# EAGLE design small_encoder_board (EAGLE 9.4.2)

## Sheet 1 of 4
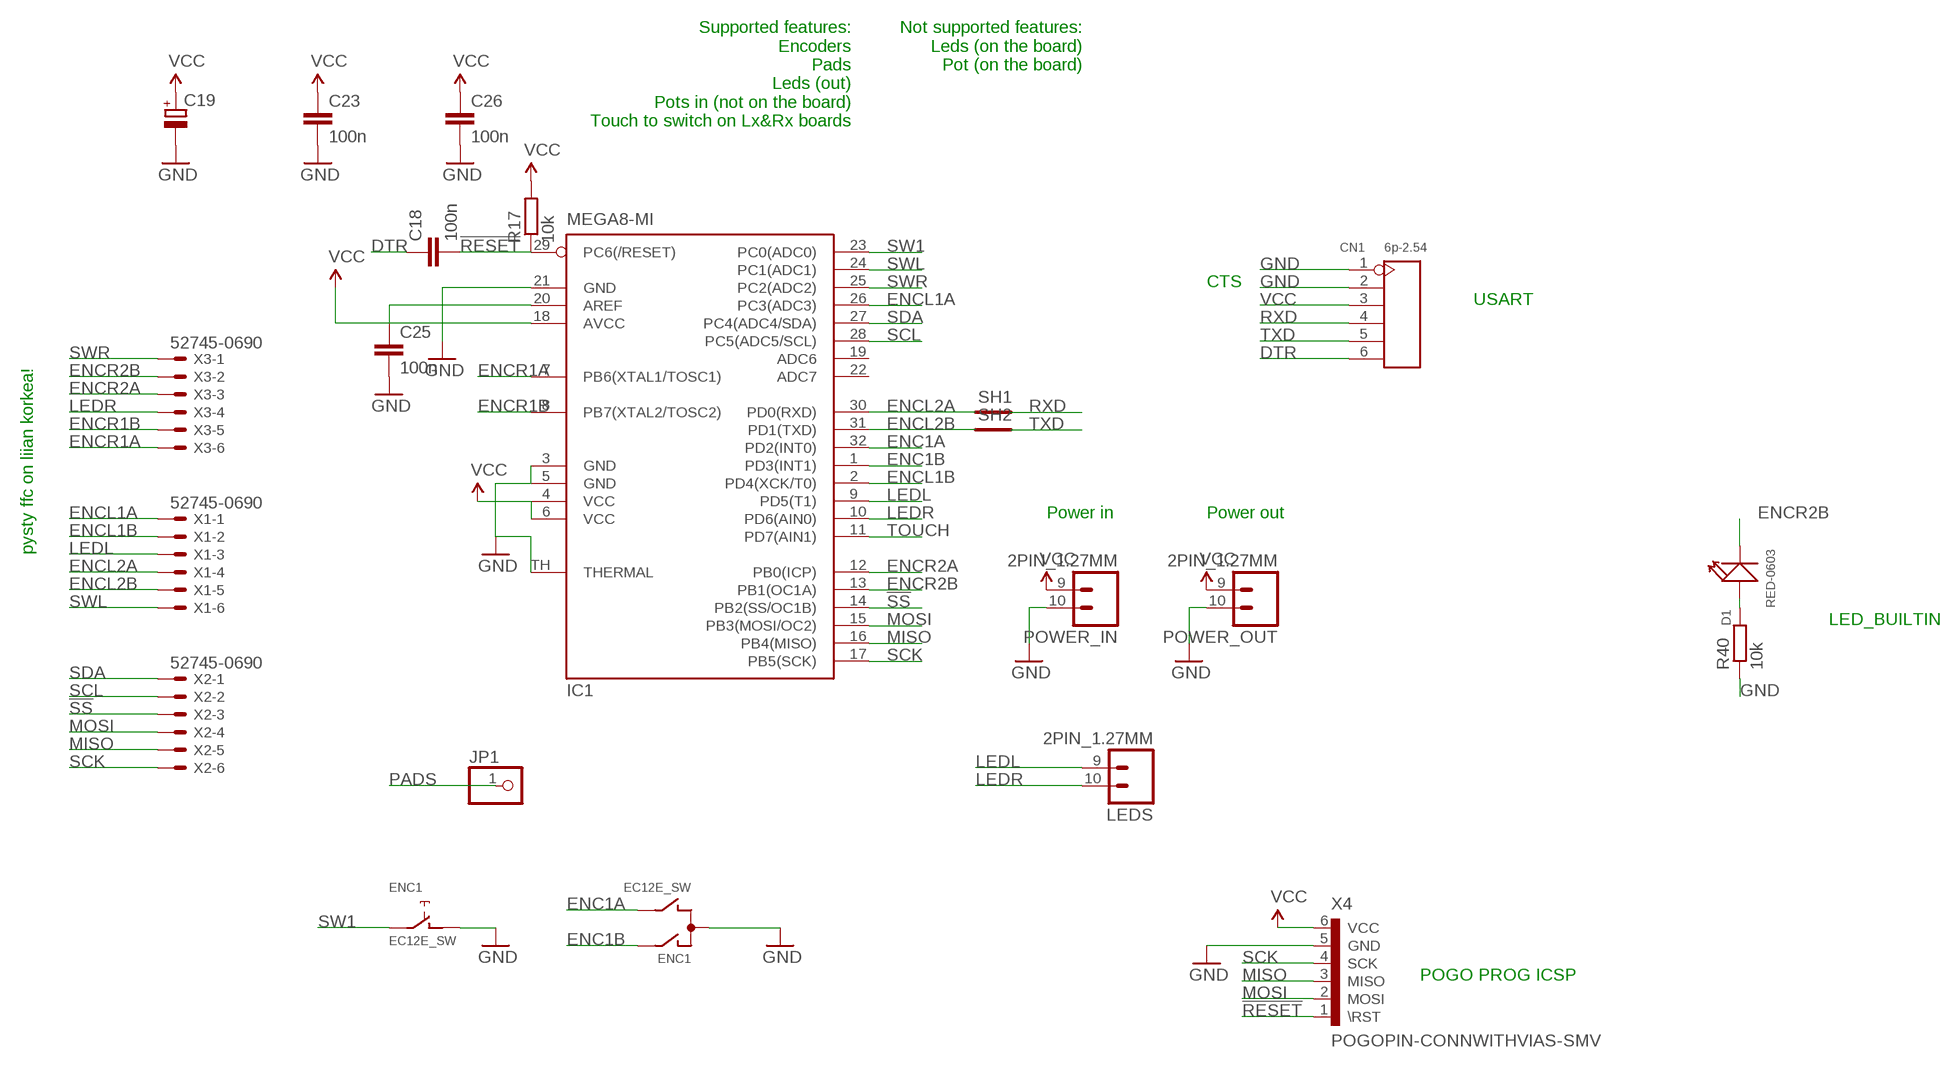
[diagram p0: schematic, sheet 1]

### Parts
C18  100n  CAP0603-CAP  [0603-CAP]
C19  CPOL-EUC  [PANASONIC_C]
C23  100n  CAP0603-CAP  [0603-CAP]
C25  100n  CAP0603-CAP  [0603-CAP]
C26  100n  CAP0603-CAP  [0603-CAP]
CN1  6p-2.54  DIP-BLACK-FEMALE-HEADER-VERT(6P-2.54)  [H6-2.54]
D1  RED-0603  LED-SMD-RED-DIFFUSED(0603)  [LED-0603]
ENC1  EC12E_SW  [ALPS_EC12E_SW]
IC1  MEGA8-MI  [MLF32-TH]
JP1  PINHD-1X1  [1X01]
LEDS  2PIN_1.27MM  [1X02_1.27MM_NO_SILK]
POWER_IN  2PIN_1.27MM  [1X02_1.27MM_NO_SILK]
POWER_OUT  2PIN_1.27MM  [1X02_1.27MM_NO_SILK]
R17  10k  R-EU_R0603  [R0603]
R40  10k  R-EU_R0603  [R0603]
SH1  SHORT  [SHORT_TOP_8MIL]
SH2  SHORT  [SHORT_TOP_8MIL]
X1  52745-0690  [52745-0690]
X2  52745-0690  [52745-0690]
X3  52745-0690  [52745-0690]
X4  POGOPIN-CONNWITHVIAS-SMV  [POGOPROG-CONN-OH-SMALLERVIAS]

### Nets
!RESET: C18.2 IC1.29(PC6(/RESET)) R17.1 X4.1(\RST)
!SS: IC1.14(PB2(SS/OC1B)) X2.3
AREF: C25.1 IC1.20(AREF)
DTR: C18.1 CN1.6
ENC1A: ENC1.B IC1.32(PD2(INT0)) ; also sheet 4
ENC1B: ENC1.A IC1.1(PD3(INT1)) ; also sheet 4
ENCL1A: IC1.26(PC3(ADC3)) X1.1 ; also sheet 4
ENCL1B: IC1.2(PD4(XCK/T0)) X1.2 ; also sheet 4
ENCL2A: IC1.30(PD0(RXD)) SH1.P$1 X1.4 ; also sheet 4
ENCL2B: IC1.31(PD1(TXD)) SH2.P$1 X1.5 ; also sheet 4
ENCR1A: IC1.7(PB6(XTAL1/TOSC1)) X3.6 ; also sheet 4
ENCR1B: IC1.8(PB7(XTAL2/TOSC2)) X3.5 ; also sheet 4
ENCR2A: IC1.12(PB0(ICP)) X3.3 ; also sheet 4
ENCR2B: D1.- IC1.13(PB1(OC1A)) X3.2 ; also sheet 4
GND: C19.- C23.2 C25.2 C26.2 CN1.1 CN1.2 ENC1.C ENC1.D IC1.3(GND) IC1.5(GND) IC1.21(GND) IC1.TH(THERMAL) POWER_IN.10 POWER_OUT.10 R40.1 X4.5(GND) ; also sheet 2,3
LEDL: IC1.9(PD5(T1)) LEDS.9 X1.3
LEDR: IC1.10(PD6(AIN0)) LEDS.10 X3.4
MISO: IC1.16(PB4(MISO)) X2.5 X4.3(MISO) ; also sheet 2
MOSI: IC1.15(PB3(MOSI/OC2)) X2.4 X4.2(MOSI) ; also sheet 2
N$31: D1.+ R40.2
PADS: JP1.1 ; also sheet 4
RXD: CN1.4 SH1.P$2
SCK: IC1.17(PB5(SCK)) X2.6 X4.4(SCK) ; also sheet 2
SCL: IC1.28(PC5(ADC5/SCL)) X2.2
SDA: IC1.27(PC4(ADC4/SDA)) X2.1
SW1: ENC1.E IC1.23(PC0(ADC0)) ; also sheet 4
SWL: IC1.24(PC1(ADC1)) X1.6 ; also sheet 4
SWR: IC1.25(PC2(ADC2)) X3.1 ; also sheet 4
TOUCH: IC1.11(PD7(AIN1)) ; also sheet 3,4
TXD: CN1.5 SH2.P$2
VCC: C19.+ C23.1 C26.1 CN1.3 IC1.4(VCC) IC1.6(VCC) IC1.18(AVCC) POWER_IN.9 POWER_OUT.9 R17.2 X4.6(VCC) ; also sheet 3
Unconnected: ENC1.GND1(G) ENC1.GND2(G) IC1.19(ADC6) IC1.22(ADC7)

### Notes on the sheet
- Supported features:
  Encoders
  Pads
  Leds (out)
  Pots in (not on the board)
  Touch to switch on Lx&Rx boards
- Not supported features:
  Leds (on the board)
  Pot (on the board)
- CTS
- USART
- Power in | Power out
- pysty ffc on liian korkea!
- LED_BUILTIN
- POGO PROG ICSP

## Sheet 2 of 4
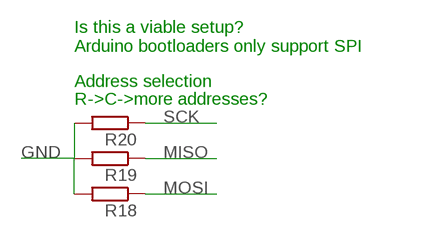
[diagram p1: schematic, sheet 2]

### Parts
R18  R-EU_R0603  [R0603]
R19  R-EU_R0603  [R0603]
R20  R-EU_R0603  [R0603]

### Nets
GND: R18.2 R19.2 R20.2 ; also sheet 1,3
MISO: R19.1 ; also sheet 1
MOSI: R18.1 ; also sheet 1
SCK: R20.1 ; also sheet 1

### Notes on the sheet
- Is this a viable setup?
  Arduino bootloaders only support SPI
- Address selection
- R->C->more addresses?

## Sheet 3 of 4
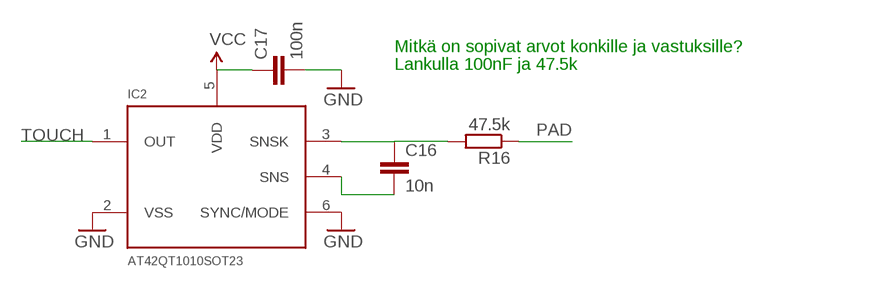
[diagram p2: schematic, sheet 3]

### Parts
C16  10n  CAP0603-CAP  [0603-CAP]
C17  100n  CAP0603-CAP  [0603-CAP]
IC2  AT42QT1010SOT23  [SOT23-6]
R16  47.5k  R-EU_R0603  [R0603]

### Nets
GND: C17.2 IC2.2(VSS) IC2.6(SYNC/MODE) ; also sheet 1,2
N$7: C16.1 IC2.3(SNSK) R16.2
N$15: C16.2 IC2.4(SNS)
PAD: R16.1
TOUCH: IC2.1(OUT) ; also sheet 1,4
VCC: C17.1 IC2.5(VDD) ; also sheet 1

### Notes on the sheet
- Mitkä on sopivat arvot konkille ja vastuksille?
- Lankulla 100nF ja 47.5k

## Sheet 4 of 4
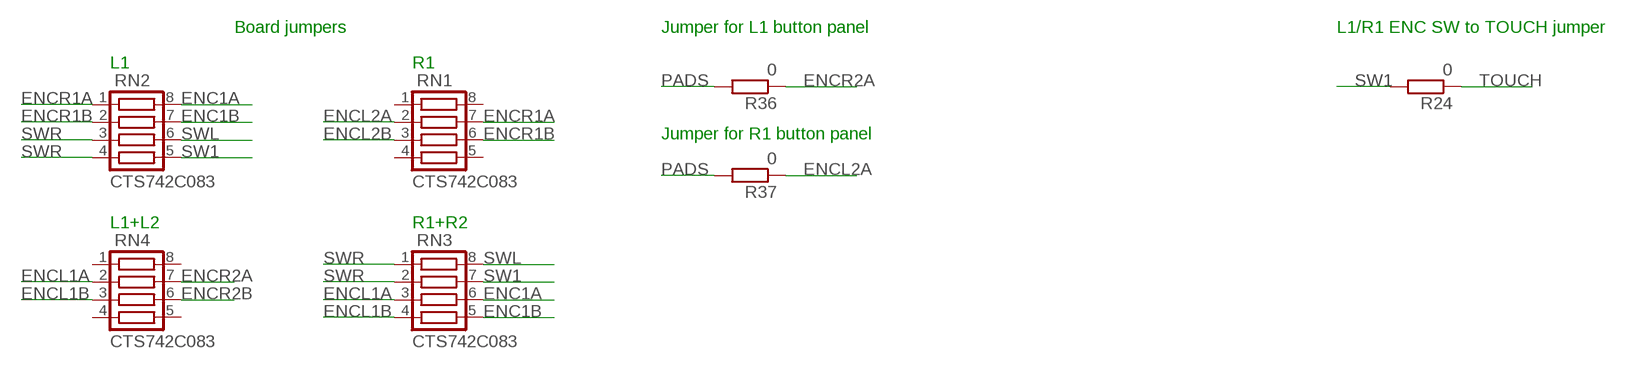
[diagram p3: schematic, sheet 4]

### Parts
R24  0  R-EU_R0603  [R0603]
R36  0  R-EU_R0603  [R0603]
R37  0  R-EU_R0603  [R0603]
RN1  CTS742C083  [CTS742C083]
RN2  CTS742C083  [CTS742C083]
RN3  CTS742C083  [CTS742C083]
RN4  CTS742C083  [CTS742C083]

### Nets
ENC1A: RN2.8 RN3.6 ; also sheet 1
ENC1B: RN2.7 RN3.5 ; also sheet 1
ENCL1A: RN3.3 RN4.2 ; also sheet 1
ENCL1B: RN3.4 RN4.3 ; also sheet 1
ENCL2A: R37.1 RN1.2 ; also sheet 1
ENCL2B: RN1.3 ; also sheet 1
ENCR1A: RN1.7 RN2.1 ; also sheet 1
ENCR1B: RN1.6 RN2.2 ; also sheet 1
ENCR2A: R36.1 RN4.7 ; also sheet 1
ENCR2B: RN4.6 ; also sheet 1
PADS: R36.2 R37.2 ; also sheet 1
SW1: R24.2 RN2.5 RN3.7 ; also sheet 1
SWL: RN2.6 RN3.8 ; also sheet 1
SWR: RN2.3 RN2.4 RN3.1 RN3.2 ; also sheet 1
TOUCH: R24.1 ; also sheet 1,3
Unconnected: RN1.1 RN1.4 RN1.5 RN1.8 RN4.1 RN4.4 RN4.5 RN4.8

### Notes on the sheet
- Board jumpers | Jumper for L1 button panel | L1/R1 ENC SW to TOUCH jumper
- L1 | R1
- Jumper for R1 button panel
- L1+L2 | R1+R2

## Library data of the parts
C16-C18 C23 C25 C26 = SparkFun-Capacitors:CAP: Capacitor Standard 0603 ceramic capacitor, and 0.1" leaded capacitor.
C19 = rcl:CPOL-EU: POLARIZED CAPACITOR, European symbol; SPICEPREFIX: C
CN1 = i2c_encoder:DIP-BLACK-FEMALE-HEADER-VERT(6P-2.54): 320030060; MPN: F185-1106A1BSYC1
D1 = Seeed-LED-2016:LED-SMD-RED-DIFFUSED(0603): 304090042; MPN: 19-217-R6C-AL1M2VY-3T
ENC1 = switch_pec:EC12E_SW: ALPS rotary Encoder EC12E series with switch; MPN: EC12E2424407; OC_FARNELL: 1520813; OC_NEWARK: 74M1068
IC1 = atmel:MEGA8-MI: MICROCONTROLLER 8 Kbytes FLASH, 1 kbytes SRAM, 512 bytes EEPROM, USART, 6-channel 10 bit ADC, 2-channel 8 bit ADC Pin compatible with Atmega48, ATMega88, ATMega168 Source: avr.lbr; MPN: ATMEGA88PA-MU; OC_FARNELL: 1715491; OC_NEWARK: 15R0272
IC2 = touch_sensor:AT42QT1010: Atmel AT42QT1010 The AT42QT1010 (QT1010) is a digital burst mode charge-transfer (QT™) sensor that is capable of detecting nearproximityor touch, making it ideal for implementing touch controls.The QT1010 is designed specifically for human interfaces, like control panels, appliances, toys, lighting controls, or anywhere a mechanical switch or button may be found. It includes all hardware and signal processing functions necessary to provide stable sensing under a wide variety of changing conditions. Only a single low-cost capacitor is required for operation. This chip is identical to the AT42QT1011, however the capsense times out after 60 seconds. Reciprocally, the capsense on the 1011 never times out. Reference "Signal Processing" in the datasheet. Datasheet <http://www.atmel.com/images/Atmel-9541-AT42-QTouch-BSW-AT42QT1010_Datasheet.pdf> Sparkfun Products Sparkfun Capacitive Touch Breakout <https://www.sparkfun.com/products/12041> (SEN-12041)
JP1 = pinhead_plus:PINHD-1X1: PIN HEADER
LEDS POWER_IN POWER_OUT = edge:2PIN_1.27MM
R16-R20 R40 = rcl:R-EU_: RESISTOR, European symbol
R24 R36 R37 = rcl:R-EU_: RESISTOR, European symbol; SPICEPREFIX: R
RN1-RN4 = resistor-net:CTS742C083: Chip Resistor Array 4 Single Resistor Source: http://www.ctscorp.com/components/Datasheets/CTSChipArrayDs.pdf; OC_FARNELL: unknown; OC_NEWARK: unknown
SH1 SH2 = shorts:SHORT: Short between two nets
X1-X3 = i2c_encoder:52745-0690: FFC/FPC-to-Board 0.50mm (.020") SMT Top Contact Right Angle, ZIF, Style Receptacle 52745 / 52435 Source: http://www.molex.com/product/ffc/52745.html; MF: MOLEX; MPN: 52745-0690; OC_FARNELL: unknown; OC_NEWARK: 92M6374
X4 = Protofusion:POGOPIN-CONN: Protofusion custom pogo pin programming header

## Board
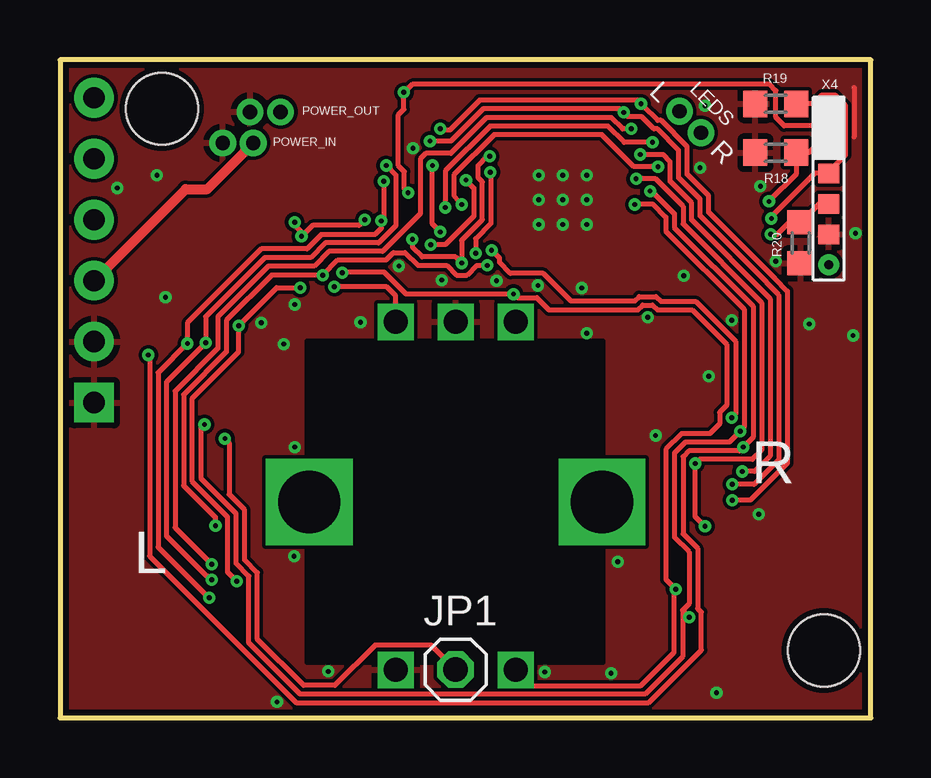
[diagram p4: board, top side]
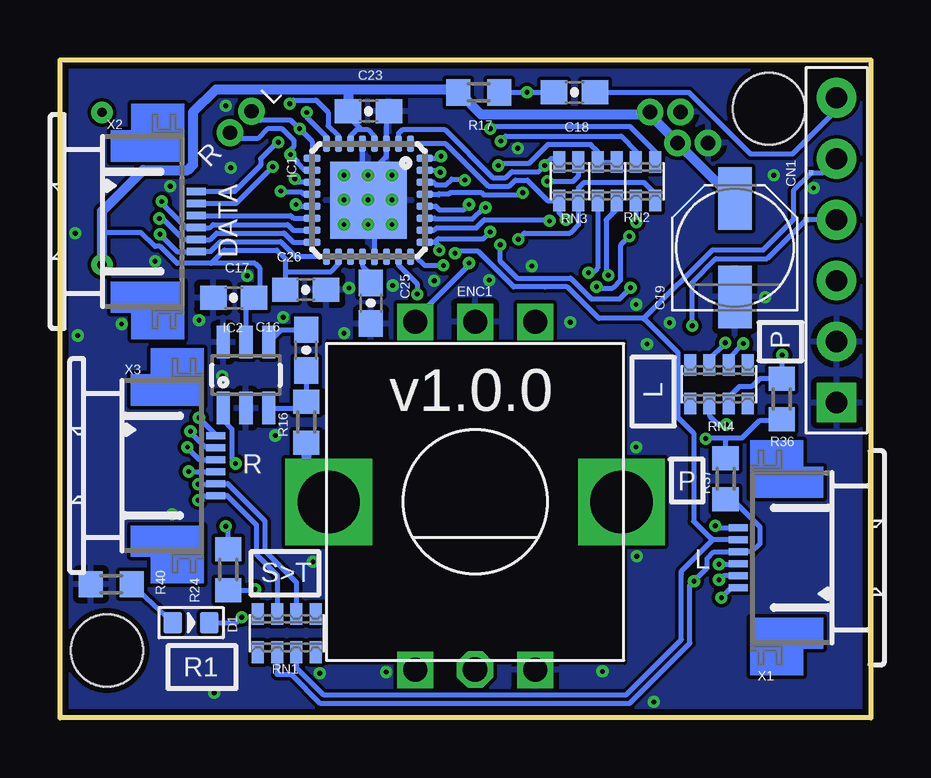
[diagram p5: board, bottom side, seen from below]

Size 33.78 x 27.41 mm. Coordinates in mm from the lower left corner, seen from the top.
Outline: 0,0 33.78,0 33.78,27.41 0,27.41 0,0
Copper layers (1*16): Top 0.035mm / dielectric 1.5mm / Bottom 0.035mm
Design rules "SeeedStudio_2layer_DRU_no_angle_20140221 *": minimum track width 4mil, minimum drill 0.2mm, track to track 6mil, track to pad 6mil, pad to pad 6mil, via to via 6mil, smd to smd 0mil, copper to edge 10mil, drill to drill 10mil, minimum pad ring 10mil, minimum via ring 6mil, stop-mask expansion 2mil, vias tented up to drill 100mil, thermal gap 10mil
Holes 3 mm at 31.83,2.8 4.24,25.37
tRestrict: area 10.3,2.3 to 22.6,15.7
bRestrict: area 10.3,2.3 to 22.6,15.7

### Footprints (pad centres in the part's own frame; a part is rotated, then mirrored left to right if it is on the bottom)
0603-CAP = smd 1.1 x 1: 1 -0.85,0; 2 0.85,0
PANASONIC_C = smd 2.6 x 1.4: + 2.05,0; - -2.05,0
H6-2.54 = drill 0.889 pad 1.651 square: 1 0,6.35 | drill 0.889 pad 1.651: 2 0,3.81; 3 0,1.27; 4 0,-1.27; 5 0,-3.81; 6 0,-6.35
LED-0603 = smd 0.762 x 0.889: + -0.762,0; - 0.762,0
ALPS_EC12E_SW = drill 1 square: A -2.5,-7.5; B 2.5,-7.5; C 0,-7.5; D -2.5,7; E 2.5,7 | drill 2.6 square: GND1 -6.1,0; GND2 6.1,0
MLF32-TH = smd 0.7 x 0.3: 1 -2.35,1.75; 2 -2.35,1.25; 3 -2.35,0.75; 4 -2.35,0.25; 5 -2.35,-0.25; 6 -2.35,-0.75; 7 -2.35,-1.25; 8 -2.35,-1.75; 17 2.35,-1.75; 18 2.35,-1.25; 19 2.35,-0.75; 20 2.35,-0.25; 21 2.35,0.25; 22 2.35,0.75; 23 2.35,1.25; 24 2.35,1.75 | smd 0.3 x 0.7: 9 -1.75,-2.35; 10 -1.25,-2.35; 11 -0.75,-2.35; 12 -0.25,-2.35; 13 0.25,-2.35; 14 0.75,-2.35; 15 1.25,-2.35; 16 1.75,-2.35; 25 1.75,2.35; 26 1.25,2.35; 27 0.75,2.35; 28 0.25,2.35; 29 -0.25,2.35; 30 -0.75,2.35; 31 -1.25,2.35; 32 -1.75,2.35 | smd 3.2 x 3.2: TH 0,0
SOT23-6 = smd 0.55 x 1.35: 1 -0.95,-1.375; 2 0,-1.375; 3 0.95,-1.375; 4 0.95,1.375; 5 0,1.375; 6 -0.95,1.375
1X01 = drill 1.016 octagon: 1 0,0
1X02_1.27MM_NO_SILK = drill 0.6: 9 0,0; 10 1.27,0
R0603 = smd 1 x 1.1: 1 -0.85,0; 2 0.85,0
CTS742C083 = smd 0.5 x 0.9: 1 -1.2,-0.8; 2 -0.4,-0.8; 3 0.4,-0.8; 4 1.2,-0.8; 5 1.2,0.8; 6 0.4,0.8; 7 -0.4,0.8; 8 -1.2,0.8
SHORT_TOP_8MIL = smd 0.203 x 0.203: P$1 0,0; P$2 0,0
52745-0690 = smd 0.3 x 0.8: 1 -1.25,2.5; 2 -0.75,2.5; 3 -0.25,2.5; 4 0.25,2.5; 5 0.75,2.5; 6 1.25,2.5
POGOPROG-CONN-OH-SMALLERVIAS = drill 0.381: 1 0,2.54; 6 0,-3.81 | smd 0.889 x 0.813: 2 0,1.27; 3 0,0; 4 0,-1.27; 5 0,-2.54

### Placement (x,y rotation side)
C16  23.52,15.32 90 bottom
C17  26.54,17.5 180 bottom
C18  12.34,26.06 180 bottom
C19  5.66,19.58 90 bottom
C23  20.93,25.27 0 bottom
C25  20.83,17.27 270 bottom
C26  23.55,17.83 0 bottom
CN1  1.42,19.48 180 bottom
D1  28.32,3.96 0 bottom
ENC1  16.48,8.99 180 bottom
IC1  20.93,21.56 270 bottom
IC2  26.04,14.27 0 bottom
JP1  16.48,2.01 0 top
LEDS  25.81,25.27 315 top
POWER_IN  8.05,23.95 0 bottom
POWER_OUT  9.19,25.25 180 top
R16  23.52,12.32 90 bottom
R17  16.33,26.06 180 bottom
R18  29.82,23.55 180 top
R19  29.82,25.58 180 top
R20  30.86,19.79 270 top
R24  26.77,6.17 270 bottom
R36  3.71,13.28 270 bottom
R37  6.05,9.96 90 bottom
R40  31.65,5.56 0 bottom
RN1  24.33,3.53 0 bottom
RN2  10.19,22.35 180 bottom
RN3  11.79,22.35 180 bottom
RN4  6.32,13.89 180 bottom
SH1  2.69,20.75 0 bottom
SH2  2.49,22.71 0 bottom
X1  3.02,6.67 90 bottom
X2  30.61,20.68 270 bottom
X3  29.79,10.5 270 bottom
X4  32.03,22.68 0 top

### Tracks (layer width: path | path; a pad name or v marks a point on that pad's centre or on a via)
!RESET  (via drill 0.2)
  Top 0.203: X4.1 31.47,24.66 30.18,24.66 29.82,25.01 29.82,26.13 29.57,26.39 14.68,26.39 14.33,26.04 | 14.33,26.04 14.33,25.35 14.1,25.12 14.1,23.01 14.35,22.75 14.35,22.02 v14.5,21.87 | 14.33,26.04 v14.33,26.06
  Bottom 0.203: C18.2 v14.33,26.06 R17.1 | IC1.29 18.02,21.81 | 18,21.79 18.02,21.81 | v14.5,21.87 14.58,21.79 16.12,21.79 16.23,21.89 17.51,21.89 17.56,21.84 17.99,21.84 18.02,21.81
!SS
  Bottom 0.203: IC1.14 24.06,20.81 24.17,20.93 X2.3
AREF
  Bottom 0.203: C25.1 20.83,18.49 21.18,18.84 IC1.20
DTR
  Bottom 0.203: CN1.6 1.42,25.32 3.25,23.49 5.02,23.49 7.58,26.06 C18.1
ENC1A  (via drill 0.2)
  Top 0.203: v17.91,23.39 17.81,23.39 17.42,23.01 17.42,22.51 17.6,22.33 17.6,20.76 16.74,19.89 v16.74,18.95 16.48,19.2 15.09,19.2 14.68,19.61 v14.68,19.94
  Bottom 0.203: RN2.8 8.98,21.84 9.46,22.31 11.94,22.31 12.19,22.06 RN3.6 12.19,20.54 12.53,20.19 14.43,20.19 v14.68,19.94 | IC1.32 17.99,23.31 v17.91,23.39 | ENC1.B 18.98,16.63 16.74,18.87 v16.74,18.95
ENC1B  (via drill 0.2)
  Top 0.203: 12.62,20.68 v12.7,20.75 12.47,20.52 10.52,20.52 v10.06,20.06 10.06,20.24 9.78,20.52 v9.78,20.65 | ENC1.A 13.98,17.58 13.61,17.96 v11.43,17.96
  Bottom 0.203: IC1.1 17.7,23.91 15.93,22.15 15.06,22.15 14.81,22.4 14.31,22.4 13.46,21.55 RN3.5 12.99,21.04 v12.7,20.75 | v9.78,20.65 RN2.7 | v10.06,20.06 10.44,19.69 10.44,18.23 10.76,17.9 11.38,17.9 v11.43,17.96
ENCL1A  (via drill 0.2)
  Top 0.203: v13.49,22.35 13.49,20.8 v13.39,20.7 13.39,20.4 13.13,20.14 10.9,20.14 10.29,19.53 8.39,19.53 5.31,16.45 v5.31,15.6 4.09,14.38 4.09,7.11 6.2,5 v6.22,5
  Bottom 0.203: v13.49,22.35 12.4,22.35 12.19,22.57 RN3.3 | X1.1 5.81,5.42 v6.22,5 | IC1.26 18.2,20.31 18.1,20.42 16.44,20.42 16.1,20.75 13.44,20.75 v13.39,20.7 | v5.31,15.6 5.92,14.98 RN4.2
ENCL1B  (via drill 0.2)
  Top 0.203: v13.59,23.01 13.99,22.61 13.99,20.5 13.28,19.79 11.05,19.79 10.44,19.18 8.53,19.18 6.07,16.71 v6.07,15.62 4.45,14 4.45,7.57 6.12,5.9 6.17,5.9 v6.33,5.75
  Bottom 0.203: IC1.2 19.68,24.01 19.68,24.33 19.49,24.52 17.76,24.52 15.74,22.5 15.21,22.5 14.96,22.76 13.84,22.76 v13.59,23.01 13.3,23.3 13.14,23.3 RN3.4 | X1.2 6.09,5.92 6.12,5.9 6.17,5.9 v6.33,5.75 | v6.07,15.62 6.07,15.61 6.72,14.95 RN4.3
ENCL2A  (via drill 0.2, 0.2 pad 0.15)
  Top 0.203: v16.92,22.4 17.25,22.07 17.25,20.9 16.05,19.71 v15.44,19.71 | v10.01,17.92 9.03,17.92 v7.44,16.33 7.44,15.25 5.51,13.32 5.51,9.84 6.98,8.36 6.98,6.07 v7.37,5.69
  Bottom 0.203: X1.4 | IC1.30 18.22,22.31 18.11,22.2 17.71,22.2 17.46,22.44 16.95,22.44 v16.92,22.4 | v10.01,17.92 10.01,17.89 10.46,17.45 11.64,17.45 12.5,18.31 14.73,18.31 15.44,19.02 v15.44,19.71 | RN1.2 24.74,1.8 24.15,1.8 22.96,0.61 10.04,0.61 7.54,3.11 7.54,5.54 7.38,5.69 v7.37,5.69 6.83,6.22 6.83,6.61 6.53,6.91 X1.4 | SH1.P$1 4.32,19.13 6.45,19.13 7.44,18.14 v7.44,16.33 | R37.1 5.78,9.11 4.62,7.95 4.62,7.24 4.95,6.91 X1.4
ENCL2B  (via drill 0.2 pad 0.15)
  Top 0.203: v17.32,19.36 17.32,19.96 17.96,20.6 17.96,22.71 v17.93,22.73
  Bottom 0.203: v17.32,19.36 17.22,19.46 16.38,19.46 14.88,17.95 13.57,17.95 13.57,17.96 12.65,17.96 12.29,17.6 11.33,16.64 9.45,16.64 | IC1.31 18.01,22.81 v17.93,22.73 | RN1.3 23.93,2.09 22.81,0.96 10.19,0.96 7.89,3.26 7.89,5.99 | X1.5 6.59,7.42 | 6.59,7.42 7.89,6.11 7.89,5.99 | 7.89,5.99 | SH2.P$1 3.2,22 3.2,20.78 4.5,19.48 6.6,19.48 9.45,16.64 | 6.59,7.42 6.66,7.5 6.69,7.5 7.38,8.18 7.38,11.86 8.03,12.51 8.03,15.22 9.45,16.64 | 9.46,16.62 9.45,16.64
ENCR1A  (via drill 0.2)
  Top 0.203: v28.02,9.07 28.77,9.07 30.3,10.61 30.3,17.78 29.79,18.29 27.03,21.06 27.03,21.75 26.14,22.64 26.14,23.8 25.05,24.89 24.9,24.89 24.31,25.48 24.3,25.48 v24.21,25.58 24.05,25.73 17.48,25.73 16.24,24.49 15.85,24.49 v15.85,24.54
  Bottom 0.203: v28.02,9.07 27.84,9.25 27.82,9.25 27.81,9.25 X3.6 26.8,9.25 25.6,8.05 25.6,6.81 24.73,5.94 RN1.7 | v24.21,25.58 24.05,25.73 23.11,25.73 22.61,25.22 22.61,24.66 22.18,24.26 IC1.7 | RN2.1 8.98,23.59 10.03,24.64 15.75,24.64 v15.85,24.54
ENCR1B  (via drill 0.2)
  Top 0.203: v28.02,9.73 28.92,9.73 29.95,10.75 29.95,17.62 29.44,18.13 29.44,18.14 26.67,20.91 26.67,21.61 25.78,22.5 25.78,23.65 24.9,24.54 24.74,24.54 24.23,25.04 23.67,25.04 v23.5,25.22 v23.49,25.22 23.34,25.38 17.63,25.38 16.29,24.03 v15.42,24.03
  Bottom 0.203: IC1.8 22.68,24.2 23.5,25.02 v23.5,25.22 | v28.02,9.73 27.32,9.73 X3.5 26.8,9.76 25.25,8.2 25.25,6.96 23.93,5.65 RN1.6 | RN2.2 9.79,23.61 10.4,24.23 15.21,24.23 v15.42,24.03
ENCR2A  (via drill 0.2, 0.2 pad 0.15)
  Top 0.203: v24.59,21.95 24.66,21.95 25.6,21.01 25.6,20.43 28.88,17.15 28.88,11.68 v28.47,11.28 28.32,11.12 26.2,11.12 25.96,10.88 25.96,7.67 26.57,7.06 26.57,4.55 26.72,4.4 26.72,2.82 24.53,0.63 9.84,0.63 3.73,6.73 3.73,15.06 v3.68,15.11
  Bottom 0.203: v24.59,21.95 24.56,21.92 23.74,21.92 23.64,21.81 IC1.12 | X3.3 27.97,10.75 28.47,11.25 v28.47,11.28 | RN4.7 5.92,13.35 5.48,13.8 4.96,13.8 4.62,14.13 R36.1 3.68,14.16 v3.68,15.11
ENCR2B  (via drill 0.2, 0.2 pad 0.15)
  Top 0.203: v23.95,21.39 24.72,21.39 25.25,20.86 25.25,20.28 28.5,17.02 28.5,12.1 v28.35,11.94 27.89,11.48 26.06,11.48 25.6,11.03 25.6,7.52 26.21,6.91 26.21,4.75 25.94,4.49 25.94,4.46 | 25.94,4.46 25.94,2.55 24.38,0.98 10.01,0.98 7.87,3.12 7.87,5.9 7.34,6.43 7.34,8.51 5.87,9.98 5.87,12.07 v6.02,12.22 | 25.94,4.46 v26.21,4.19
  Bottom 0.203: IC1.13 23.88,21.31 v23.95,21.39 | X3.2 27.31,11.27 27.72,11.27 28.35,11.9 v28.35,11.94 | D1.- 26.44,3.96 v26.21,4.19 | 6.74,13.08 RN4.6 6.72,12.59 6.35,12.22 v6.02,12.22
GND  (via drill 0.2)
  Top 0.203: 33.08,24.19 33.08,26.25 33.1,26.26
  Bottom 0.203: 20.28,25.07 C23.2 20.18,25.17 IC1.3 20.18,23.37 v20.95,22.6 21.18,22.83 IC1.5 | 26.98,15.8 IC2.6 | IC1.21 20.68,20.28 v20.95,20.55
  other vias: 24.82,11.76 27.36,1.04 27.03,14.22 33.05,15.93 33.15,20.19 19.95,20.55 21.95,20.55 19.95,21.58 20.95,21.58 21.95,21.58 19.95,22.6 21.95,22.6 23.24,6.5 21.74,17.91 31.22,16.41 29.18,22.15 25.98,18.41 27.99,16.56 29.11,8.48 21.95,16.03 9.75,6.73 8.38,16.46 9.32,15.57 19.91,18.01 18.19,18.21 15.9,18.24 14.12,18.82 12.52,16.48 9.78,17.22 4.04,22.61 2.39,22.07 20.19,1.91 22.96,1.85 9.78,11.28 26.67,22.91 26.87,25.5 29.82,19.02 24.49,16.69 11.18,1.93 9.04,0.66 4.39,17.53 14.71,23.72
  pour Top: -2.11,28.73 34.95,28.73 34.95,-1.24 -2.11,-1.24
  pour Bottom: -2.11,28.57 34.9,28.57 34.9,-1.17 -2.11,-1.17
LEDL  (via drill 0.2)
  Top 0.203: v23.8,24.54 23.45,24.54 22.98,25.01 17.77,25.01 16.28,23.52 15.24,23.52 15.01,23.29 15.01,22.61 15.01,21 13.44,19.43 11.2,19.43 10.59,18.82 8.68,18.82 6.58,16.72 6.58,15.39 4.8,13.61 4.8,7.93 v6.33,6.4
  Bottom 0.203: IC1.9 23.28,24.02 v23.8,24.54 v23.81,24.54 24.16,24.89 25.43,24.89 LEDS.9 | v6.33,6.4 5.54,6.4 X1.3
LEDR  (via drill 0.2)
  Top 0.203: v28.42,10.26 28.95,10.26 29.59,10.91 29.59,17.46 26.31,20.74 26.31,21.46 25.42,22.35 25.42,23.17 25.13,23.47 v24.18,23.47
  Bottom 0.152: v28.42,10.26 28.42,10.25
  Bottom 0.203: X3.4 28.41,10.25 v28.42,10.26 | IC1.10 23.59,22.81 23.9,23.12 23.9,23.19 v24.18,23.47 24.18,23.67 24.03,23.82 24.03,24.05 24.52,24.54 25.15,24.54 25.55,24.13 26.46,24.13 LEDS.10
MISO  (via drill 0.2)
  Top 0.203: R19.1 31.38,25.58 31.75,25.94 32.3,25.94 32.73,25.51 32.73,23.44 32.03,22.74 X4.3 31.44,22.68 29.64,20.88 v29.64,20.8
  Bottom 0.203: IC1.16 24.07,19.81 24.45,20.19 27.26,20.19 27.53,19.93 X2.5 28.12,19.94 28.65,19.94 29.52,20.8 v29.64,20.8
MOSI  (via drill 0.2)
  Top 0.203: v29.54,21.51 30.67,22.64 R18.1 31.2,23.55 31.61,23.95 X4.2
  Bottom 0.203: IC1.15 24.07,20.31 24.3,20.55 27.41,20.55 27.53,20.42 28.36,20.42 28.35,20.43 X2.4 28.53,20.43 29.54,21.44 v29.54,21.51
N$7
  Bottom 0.203: C16.1 R16.2 23.79,12.9 IC2.3
N$15
  Bottom 0.203: C16.2 24.57,16.17 IC2.4
N$31
  Bottom 0.203: R40.2 29.07,3.95 D1.+
PAD
  Bottom 0.406: R16.1 23.52,10.18
PADS  (via drill 0.2)
  Top 0.203: JP1.1 15.47,3.02 13.13,3.02 11.46,1.35 10.15,1.35 8.23,3.26 8.23,6.05 7.7,6.58 7.7,8.66 7.05,9.3 7.05,11.45 v6.87,11.63
  Bottom 0.203: R36.2 3.75,12.39 4.62,12.39 5.36,11.66 5.97,11.66 | v6.87,11.63 6.85,11.66 5.97,11.66 | R37.2 6.04,11.58 5.97,11.66
RXD
  Bottom 0.203: CN1.4 SH1.P$2
SCK  (via drill 0.2)
  Top 0.203: v29.62,20.14 29.9,20.14 30.39,20.64 R20.1 31.64,21.41 X4.4
  Bottom 0.203: IC1.17 22.69,19.23 23.98,19.23 24.59,19.84 27.1,19.84 27.51,19.43 27.85,19.43 X2.6 28.9,19.43 v29.62,20.14
SCL  (via drill 0.2, 0.2 pad 0.15)
  Top 0.203: v24.92,22.96 23.91,22.96 22.57,24.3 18.09,24.3 16.41,22.62 16.41,21.76 16.64,21.49 v16.74,21.39
  Bottom 0.203: v16.74,21.39 16.96,21.16 17.97,21.16 18.12,21.31 IC1.28 | v24.92,22.96 24.97,22.91 26.45,21.43 X2.2
SDA  (via drill 0.2)
  Top 0.203: v24.69,23.98 23.5,23.98 22.83,24.65 17.92,24.65 16.05,22.79 v16.05,21.26
  Bottom 0.203: IC1.27 18.17,20.81 18.15,20.79 16.6,20.79 16.13,21.26 v16.05,21.26 | X2.1 26.51,21.93 25.43,23.01 25.43,23.29 24.74,23.98 v24.69,23.98
SW1  (via drill 0.2, 0.2 pad 0.15)
  Top 0.203: 25.25,10.86 | 25.25,10.86 25.25,5.77 v25.65,5.36 25.58,5.28 25.58,2.72 24.2,1.34 19.64,1.34 ENC1.E | 25.25,10.86 25.25,11.19 25.9,11.84 27.08,11.84 27.48,12.24 27.48,12.72 27.77,13.01 27.77,15.56 26.34,16.99 24.9,16.99 24.7,17.19 24.28,17.19 24.07,16.99 20.37,16.99 19.86,17.5 19.05,17.5 v18.9,17.65 14.42,17.65 13.51,18.57 11.78,18.57 v11.76,18.54
  Bottom 0.203: IC1.23 19.68,18.87 18.9,18.08 v18.9,17.65 | RN3.7 11.39,18.74 11.58,18.54 v11.76,18.54 | R24.2 25.69,5.32 v25.65,5.36
SWL  (via drill 0.2)
  Top 0.203: v17.8,18.85 17.37,18.85 16.97,18.44 16.51,18.44 16.11,18.85 14.92,18.85 14.38,19.38 13.89,19.38 13.59,19.07 11.57,19.07 10.94,18.45 v10.94,18.43 v10.94,18.44 8.81,18.44 6.93,16.56 6.93,15.24 5.16,13.47 5.16,9.68 6.48,8.36 v6.48,8
  Bottom 0.203: 10.59,21.21 10.59,21.22 RN3.8 10.65,21.48 10.65,21.12 11.03,20.75 11.03,18.52 v10.94,18.43 | v17.8,18.85 18.58,18.85 18.95,19.21 IC1.24 | v6.48,8 6.4,7.92 X1.6
SWR  (via drill 0.2)
  Top 0.203: 15.87,20.24 v15.85,20.24 15.52,20.57 v15.52,23.01 | v17.98,19.48 18.31,19.15 18.31,18.97 18.77,18.52 20.14,18.52 21.28,17.37 23.95,17.37 24.13,17.55 24.84,17.55 25.04,17.35 26.49,17.35 28.15,15.69 28.15,12.65 v27.99,12.5
  Bottom 0.203: RN2.3 RN2.4 11.39,23.6 11.66,23.88 13.46,23.88 14.22,23.11 15.42,23.11 v15.52,23.01 | IC1.25 18.56,19.83 18.16,19.83 | 18.16,19.83 18.14,19.83 18.02,19.96 16.13,19.96 v15.85,20.24 | 18.16,19.83 17.98,19.66 v17.98,19.48 | v27.99,12.5 27.29,11.8 X3.1
TOUCH  (via drill 0.2)
  Top 0.203: v24,22.45 24.82,22.45 25.96,21.31 25.96,20.57 29.23,17.3 29.23,11.15 28.85,10.77 26.64,10.77 v26.47,10.59 26.47,8.39 v26.87,7.98
  Bottom 0.203: v26.47,10.59 26.62,10.74 26.62,12.03 26.98,12.39 IC2.1 | IC1.11 23.6,22.31 23.61,22.33 23.88,22.33 v24,22.45 | R24.1 26.77,7.88 v26.87,7.98
TXD
  Bottom 0.203: CN1.5 2.01,22.71 SH2.P$2
VCC
  Top 0.406: CN1.3 5.24,22.03 6.14,22.03 7.69,23.57 7.69,23.59 POWER_IN.9
  Bottom 0.203: 24.4,18.59 C26.1 | 24.4,18.59 22.49,18.59 22.18,18.9 IC1.18 | 21.23,24.52 20.97,24.52 20.68,24.23 IC1.4 | 21.23,24.52 21.39,24.52 21.68,24.23 IC1.6 | 21.23,24.52 21.63,24.92 21.63,25.27 | 26.02,15.67 IC2.5 26.04,17.16 C17.1 25.46,17.75 25.46,18.74 25.65,18.93 27.48,18.93 | X4.6 31.97,18.93 | 27.48,18.93 26.93,19.48 24.74,19.48 24.4,19.14 24.4,18.59 | 27.48,18.93 28.91,18.93 29.61,19.64 29.83,19.64 30.41,20.22 32.03,20.22
  Bottom 0.406: 21.63,25.27 C23.1 21.78,26.18 21.77,26.19 | 21.77,26.19 27.28,26.19 28.25,25.22 28.25,23.04 28.46,22.82 28.47,22.82 30.32,22.82 32.03,21.11 32.03,20.22 X4.6 | 21.77,26.19 17.31,26.19 R17.2 17.16,26.06 16.24,25.15 9.3,25.15 POWER_OUT.9 9.2,25.09 POWER_IN.9 7.69,23.59 7.69,23.57 5.78,21.66 5.64,21.66 C19.+

### Text on the board
tPlace: L | R
bPlace: L | R | DATA | P | L | R | P | L | S>T | R1
tNames: R | L
bNames: v1.0.0
Document: the height of an SK6812 is 1.6mm where / as the height for a smd encoder is ~4.5mm | use WS2812B or SK6812 to save on gpio pins | GPIO needed: / I2C: 2 / SPI: 4 (+ interrupt?) / encoder: 2 / leds: 1 / = 5 - 7(/8) | (c> 2 1.9) | 0.5mm FFC max current = 0.55A / http://www.axon-cable.com/publications/FFC-Flat-Cables.pdf | F+M headerit päällekkäin on noin 5.1mm? | kooderin korkeus 4+(5-7 kierteet)mm